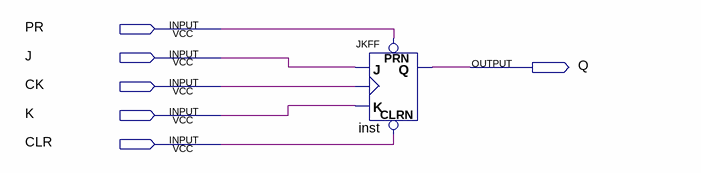
[diagram p0: schematic sheet]
// Quartus schematic JK_FF.bdf as structural Verilog: 1 symbols, 6 pins
module JK_FF (
  input  PR,
  input  J,
  input  CK,
  input  K,
  input  CLR,
  output Q
);

  JKFF inst (.PRN(PR), .CLRN(CLR), .K(K), .J(J), .CLK(CK), .Q(Q));
endmodule
